# Altium schematic sheet Controller_final.SchDoc
size 594 x 420 mm; SheetNumber: 1; SheetTotal: 3
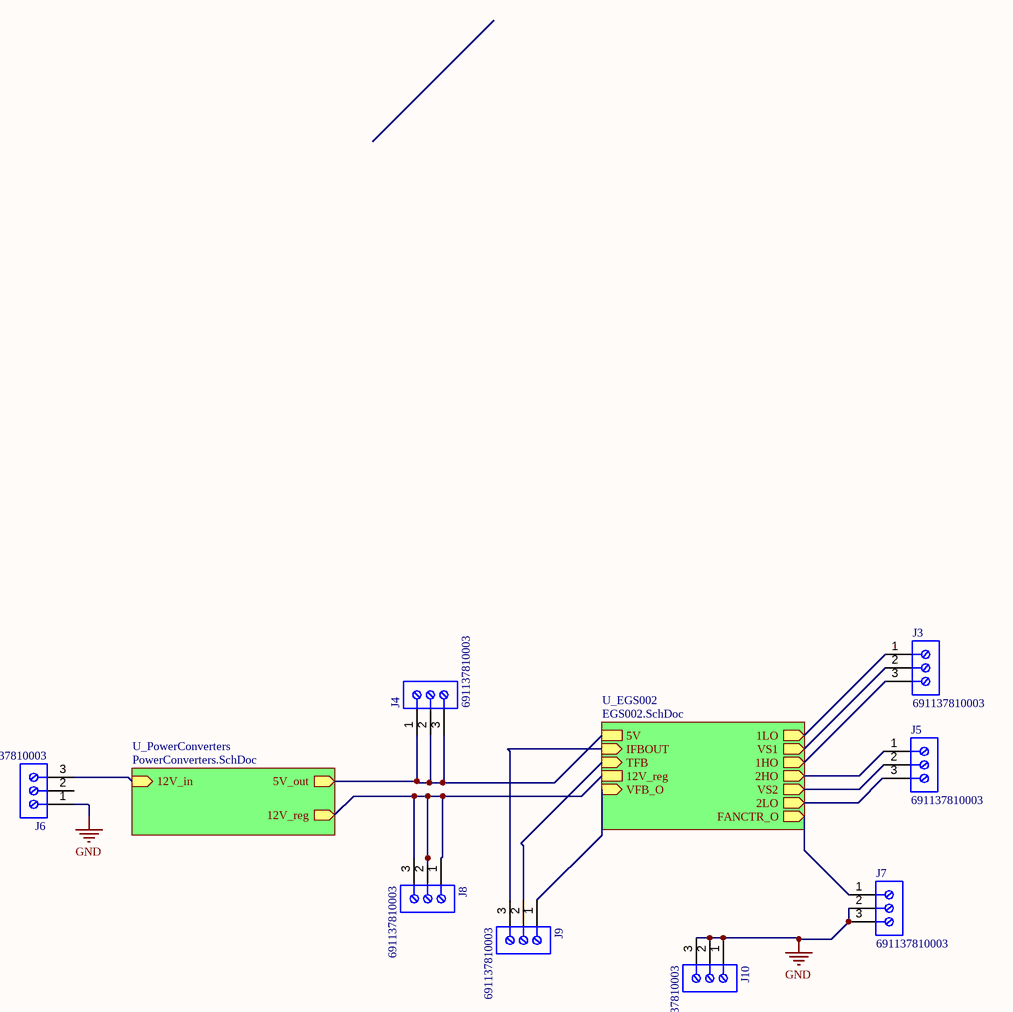
[diagram p0: Controller_final.SchDoc]

## Parts
J3  691137810003  [691137810003]
J4  691137810003  [691137810003]
J5  691137810003  [691137810003]
J6  691137810003  [691137810003]
J7  691137810003  [691137810003]
J8  691137810003  [691137810003]
J9  691137810003  [691137810003]
J10  691137810003  [691137810003]

## Sub-sheets
U_EGS002 = EGS002.SchDoc: 5V, IFBOUT (in), 1LO (out), VS1 (out), 1HO (out), TFB (in), VS2 (out), 12V_reg, FANCTR_O (out), VFB_O (in), 2HO (out), 2LO (out)
U_PowerConverters = PowerConverters.SchDoc: 12V_in (in), 5V_out (out), 12V_reg (out)

## Nets
GND: J6.1 J7.2 J7.3 J10.1 J10.2 J10.3
NetJ3_1: J3.1 ; sheet U_EGS002/1LO
NetJ3_2: J3.2 ; sheet U_EGS002/VS1
NetJ3_3: J3.3 ; sheet U_EGS002/1HO
NetJ4_1: J4.1 J4.2 J4.3 ; sheet U_PowerConverters/5V_out, sheet U_EGS002/5V
NetJ5_1: J5.1 ; sheet U_EGS002/2HO
NetJ5_2: J5.2 ; sheet U_EGS002/VS2
NetJ5_3: J5.3 ; sheet U_EGS002/2LO
NetJ6_3: J6.3 ; sheet U_PowerConverters/12V_in
NetJ7_1: J7.1 ; sheet U_EGS002/FANCTR_O
NetJ8_1: J8.1 J8.2 J8.3 ; sheet U_PowerConverters/12V_reg, sheet U_EGS002/12V_reg
NetJ9_1: J9.1 ; sheet U_EGS002/VFB_O
NetJ9_2: J9.2 ; sheet U_EGS002/TFB
NetJ9_3: J9.3 ; sheet U_EGS002/IFBOUT

Not connected (* = marked no-connect by the designer): J6 2

## Notes on the sheet
- DWG NO:
- REV:
- THIS DOCUMENT AND THE DATA DISCLOSED HEREIN OR
- HEREWITH IS THE PROPERTY OF ALTIUM LIMITED AND MAY
- BE FREELY DISTRIBUTED IN WHOLE. NO RIGHTS ARE
- RESERVED OR EXPRESS OR IMPLIED WARANTEE GIVEN.
- REVISION
- DESCRIPTION
- DATE
- APPROVED
- ENG:
- APPROVALS
- PROJECT
- DSN:
- CHK:
- REFERENCE DOCUMENTS
- PROJECT REVISION:
- TITLE
- DOCUMENT REVISION:
- DESIGN ITEM:
- BOM:
- FAB DWG:
- PCB DWG:
- ASSY DWG:
- SCALE:
- A2
- SIZE
- CAGE CODE
- FILE NAME
- DWG NO.
- SHEET
- OF
- REV

## Library data of the parts
J3-J10 = CMP-1502-03382-3: 10.00 mm Terminal Block, Horizontal Entr